# Altium schematic sheet [3] IMU.SchDoc
size A4; DocumentNumber: 3; SheetNumber: 3; SheetTotal: 5
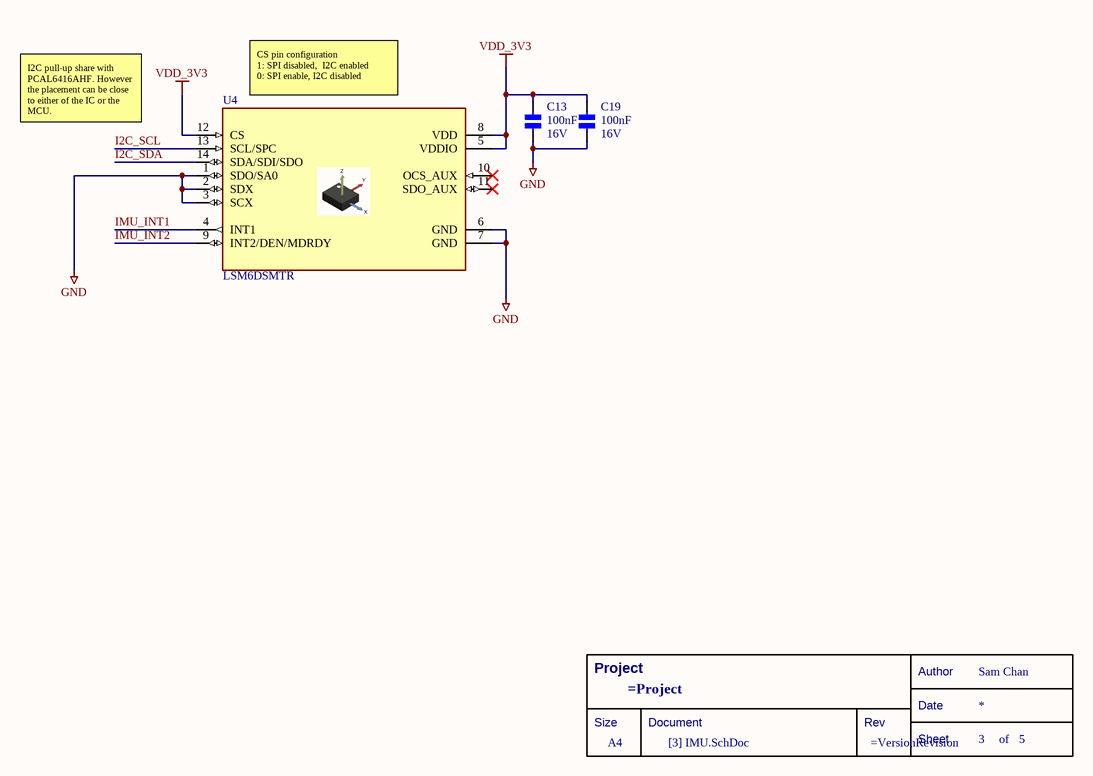
[diagram p0: [3] IMU.SchDoc]

## Parts
*  Title Block  (value not drawn)  (graphical)
C13  Voltage - Rated: 16V  [CAPC0402X05N]  (hidden comment: 100nF)
C19  Voltage - Rated: 16V  [CAPC0402X05N]  (hidden comment: 100nF)
U4  LSM6DSMTR  [LSM6DSMTR]

## Nets
GND: C13.2 C19.2 U4.1(SDO/SA0) U4.2(SDX) U4.3(SCX) U4.6(GND) U4.7(GND)
VDD_3V3: C13.1 C19.1 U4.5(VDDIO) U4.8(VDD) U4.12(CS)
I2C_SCL: U4.13(SCL/SPC)
I2C_SDA: U4.14(SDA/SDI/SDO)
IMU_INT1: U4.4(INT1)
IMU_INT2: U4.9(INT2/DEN/MDRDY)

Not connected (* = marked no-connect by the designer): U4 10(OCS_AUX)* 11(SDO_AUX)*

## Notes on the sheet
- I2C pull-up share with PCAL6416AHF. However the placement can be close to either of the IC or the MCU.
- (near U4) CS pin configuration
  1: SPI disabled,  I2C enabled
  0: SPI enable, I2C disabled
- (in symbol Title Block) Project; Author; Sam Chan; Date; Size; Document; Rev; A4; Sheet; of

## Library data of the parts
* = Title Block: Standard Title Block
C13 C19 = CER 100NF 16V: CAP CER 0.1UF 16V X7R 0402; Manufacturer: Samsung Electro-Mechanics; Manufacturer Part Number: CL05B104KO5NNNC; Category: Capacitors; Supplier 1: LCSC; Supplier Part Number 1: C1525; Package / Case: 0402; Capacitance: 100nF
U4 = LSM6DSMTR: IMU ACCEL/GYRO I2C/SPI 14LGA; Manufacturer: STMicroelectronics; Categories: IMUs (Inertial Measurement Units); Case: 14-VFLGA Module; Manufacturer Part Number: LSM6DSMTR; Supplier 1: Digi-Key; Supplier Part Number 1: 497-16696-1-ND